# Altium project UHF RFID reder.PrjPcb (part 2 of 2)

## Sheet External interfaces and connections.SchDoc
size A4; SheetNumber: 10; SheetTotal: 10
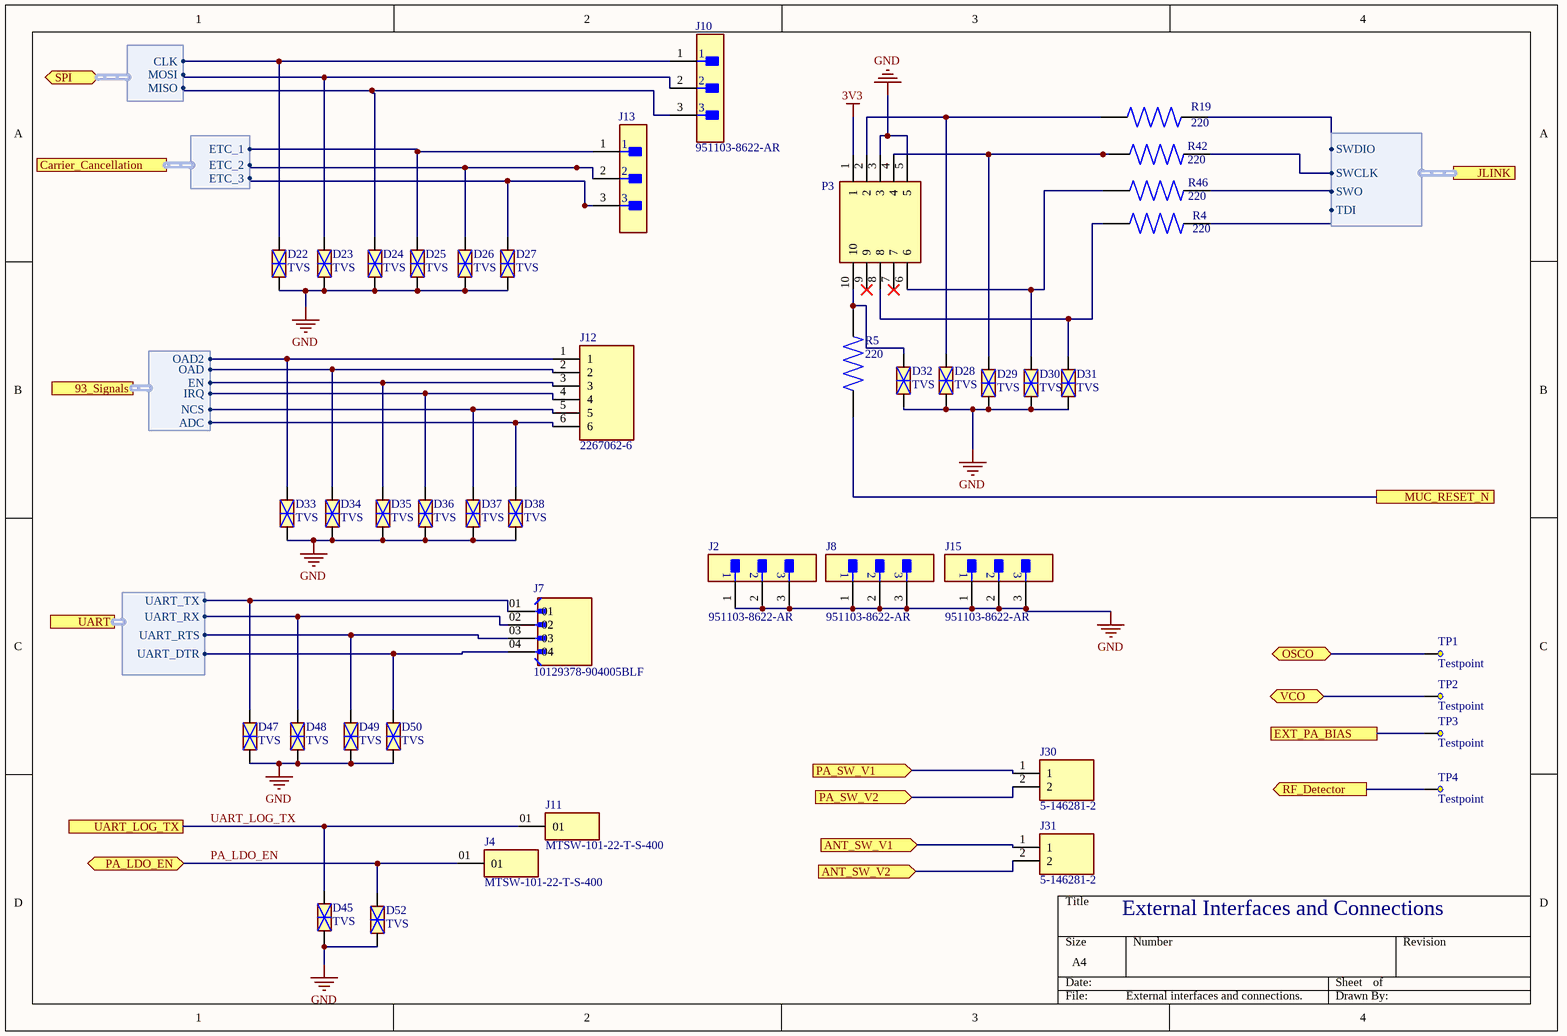
[diagram p6: External interfaces and connections.SchDoc]

### Parts
D22  TVS  [ST0201]
D23  TVS  [ST0201]
D24  TVS  [ST0201]
D25  TVS  [ST0201]
D26  TVS  [ST0201]
D27  TVS  [ST0201]
D28  TVS  [ST0201]
D29  TVS  [ST0201]
D30  TVS  [ST0201]
D31  TVS  [ST0201]
D32  TVS  [ST0201]
D33  TVS  [ST0201]
D34  TVS  [ST0201]
D35  TVS  [ST0201]
D36  TVS  [ST0201]
D37  TVS  [ST0201]
D38  TVS  [ST0201]
D45  TVS  [ST0201]
D47  TVS  [ST0201]
D48  TVS  [ST0201]
D49  TVS  [ST0201]
D50  TVS  [ST0201]
D52  TVS  [ST0201]
J2  951103-8622-AR  [FP-951103-8622-AR-MFG]
J4  MTSW-101-22-T-S-400  [SAMTEC_MTSW-101-22-T-S-400]
J7  10129378-904005BLF  [AMPHENOL_10129378-904005BLF]
J8  951103-8622-AR  [FP-951103-8622-AR-MFG]
J10  951103-8622-AR  [FP-951103-8622-AR-MFG]
J11  MTSW-101-22-T-S-400  [SAMTEC_MTSW-101-22-T-S-400]
J12  2267062-6  [TE_2267062-6]
J13  951103-8622-AR  [FP-951103-8622-AR-MFG]  (value not drawn)
J15  951103-8622-AR  [FP-951103-8622-AR-MFG]
J30  5-146281-2  [TE_5-146281-2]
J31  5-146281-2  [TE_5-146281-2]
P3  .06.04_J-LINK_NEEDLE_ADAPTER  [SEGGER_8.06.04_J-LINK_NEEDLE_ADAPTER]  (value not drawn)
R4  220  [RESC1005X40N]
R5  220  [RESC1005X40N]
R19  220  [RESC1005X40N]
R42  220  [RESC1005X40N]
R46  220  [RESC1005X40N]
TP1  Testpoint  [Testpoint_FP]
TP2  Testpoint  [Testpoint_FP]
TP3  Testpoint  [Testpoint_FP]
TP4  Testpoint  [Testpoint_FP]

### Ports
93_Signals (harness 93_Signals, see System Overview[1B], Microcontroller[4A], UHF RFID READER IC[1A]), ANT_SW_V1 (in, see System Overview[1D], Antenna Switch[2B], Microcontroller[1C]), ANT_SW_V2 (in, see System Overview[1D], Antenna Switch[2B], Microcontroller[1C]), Carrier_Cancellation (harness Carrier_Cancellation, see System Overview[1B], Carrier Cancellation Circuit[1A], Microcontroller[4B]), EXT_PA_BIAS (see System Overview[1C], External Power Amplifier[1C]), JLINK (harness JLINK, see System Overview[1C], Microcontroller[1B]), MUC_RESET_N (see System Overview[1C], Microcontroller[3B]), OSCO (bidir, see System Overview[1C], UHF RFID READER IC[1B]), PA_LDO_EN (bidir, see System Overview[1C], Microcontroller[1B], Supply LDOs[2C]), PA_SW_V1 (in, see System Overview[1C], External Power Amplifier[4A], Microcontroller[1B]), PA_SW_V2 (in, see System Overview[1C], External Power Amplifier[4A], Microcontroller[3A]), RF_Detector (out, see System Overview[1C], External Power Amplifier[3D], Microcontroller[2A]), SPI (bidir, harness SPI, see System Overview[1B], Carrier Cancellation Circuit[1A], Microcontroller[4A], UHF RFID READER IC[1A]), UART (harness UART, see System Overview[1C], Microcontroller[1A], USB suply_UART bridge[4D]), UART_LOG_TX (see System Overview[1C], Microcontroller[4A]), VCO (bidir, see System Overview[1C], UHF RFID READER IC[1B])

### Harnesses
93_Signals: EN, IRQ, NCS, ADC, OAD, OAD2
Carrier_Cancellation: ETC_1, ETC_2, ETC_3
SPI: CLK, MISO, MOSI
UART: UART_TX, UART_RX, UART_RTS, UART_DTR
JLINK: SWDIO, SWCLK, SWO, TDI

### Nets
3V3: P3.1
GND: D22.2 D23.2 D24.2 D25.2 D26.2 D27.2 D28.2 D29.1 D29.2 D30.2 D31.2 D32.2 D33.2 D34.2 D35.2 D36.2 D37.2 D38.2 D45.2 D47.2 D48.2 D49.2 D50.2 D52.2 J2.1 J2.2 J2.3 J8.1 J8.2 J8.3 J15.1 J15.2 J15.3 P3.3 P3.4 P3.5 R42.1
ADC: D38.1 J12.6 ; port 93_Signals.ADC
CLK: D22.1 J10.1 ; port SPI.CLK
Detector: TP4.TP?(Testpoint) ; port RF_Detector
DTR: D50.1 J7.04 ; port UART.UART_DTR
EN: D35.1 J12.3 ; port 93_Signals.EN
ETC_1: D25.1 J13.1 ; port Carrier_Cancellation.ETC_1
ETC_2: D26.1 J13.2 ; port Carrier_Cancellation.ETC_2
ETC_3: D27.1 J13.3 ; port Carrier_Cancellation.ETC_3
IRQ: D36.1 J12.4 ; port 93_Signals.IRQ
MISO: D24.1 J10.3 ; port SPI.MISO
MOSI: D23.1 J10.2 ; port SPI.MOSI
NCS: D37.1 J12.5 ; port 93_Signals.NCS
OAD: D34.1 J12.2 ; port 93_Signals.OAD
OAD2: D33.1 J12.1 ; port 93_Signals.OAD2
OSCO: TP1.TP?(Testpoint) ; port OSCO
PA_LDO_EN: D52.1 J4.01 ; port PA_LDO_EN
RTS: D49.1 J7.03 ; port UART.UART_RTS
RX: D48.1 J7.02 ; port UART.UART_RX
TX: D47.1 J7.01 ; port UART.UART_TX
UART_LOG_TX: D45.1 J11.01 ; port UART_LOG_TX
NetB1_1: R5.1 ; port MUC_RESET_N
NetC55_2: TP2.TP?(Testpoint) ; port VCO
NetD28_1: D28.1 P3.2 R19.1
NetD30_1: D30.1 P3.6 R46.1
NetD31_1: D31.1 P3.8 R4.1
NetD32_1: D32.1 P3.10 R5.2
NetJ30_1: J30.1 ; port PA_SW_V1
NetJ30_2: J30.2 ; port PA_SW_V2
NetJ31_1: J31.1 ; port ANT_SW_V1
NetJ31_2: J31.2 ; port ANT_SW_V2
NetR4_2: R4.2 ; port JLINK.TDI
NetR19_2: R19.2 ; port JLINK.SWDIO
NetR21_2: TP3.TP?(Testpoint) ; port EXT_PA_BIAS
NetR42_2: R42.2 ; port JLINK.SWCLK
NetR46_2: R46.2 ; port JLINK.SWO

Not connected (* = marked no-connect by the designer): P3 7* 9*

### Notes on the sheet
- External Interfaces and Connections

### Library data of the parts
D22-D38 D45 D47-D50 D52 = ESDAXLC6-1BU2: 17V Clamp 1A (8/20Âµs) Ipp Tvs Diode Surface Mount ST0201; MF: STMicroelectronics; SnapEDA_Link: https://www.snapeda.com/parts/ESDAXLC6-1BU2/STMicroelectronics/view-part/?ref=snap; Package: 0201 STMicroelectronics; Value: *; MP: ESDAXLC6-1BU2; Check_prices: https://www.snapeda.com/parts/ESDAXLC6-1BU2/STMicroelectronics/view-part/?ref=eda
J2 J8 J10 J13 J15 = CMP-05379-000003-1: CONN HEADER VERT 3POS 2MM; Manufacturer: 3M; Conn Gender: Male; Current Rating: 2A; Number Of Contacts: 3; Conn Orientation: Straight; Digikey Description: CONN HEADER VERT 3POS 2MM; Device Class L3: unset; Category: Conn; Height: 6.3mm; Manufacturer Part Number: 951103-8622-AR; RoHS: TRUE; Contact Material: Gold,Nickel; ComponentLink2Description: Datasheet; Temperature Range Low: -55°C; Device Class L1: Connectors; Pitch: 2mm; Mouser Description: Header; PinStrip; CopperAlloy; HighTempThermoplastic; 3Cnts; 1A; RtAngle; 951Series; Octopart: https://octopart.com/951103-8622-ar-3m-14400669; Package: 951103-8622-AR; Lead Free: Yes; Device Class L2: Headers and Wire Housings; Temperature Range High: +125°C; ComponentLink2URL: http://multimedia.3m.com/mws/media/1400506O/3m-pin-strip-header-951-series-78-5100-2653-3.pdf; Automotive: No; Temperature: -55°C to +125°C; Number Of Rows: 1
J4 J11 = MTSW-101-22-T-S-400: Connector Header Through Hole 1 position; MF: Samtec; Check_prices: https://www.snapeda.com/parts/MTSW-101-22-T-S-400/Samtec/view-part/?ref=eda; Purchase-URL: https://pricing.snapeda.com/search/part/MTSW-101-22-T-S-400/?ref=eda; SnapEDA_Link: https://www.snapeda.com/parts/MTSW-101-22-T-S-400/Samtec/view-part/?ref=snap; Price: None; Value: *; MP: MTSW-101-22-T-S-400; Package: None; Availability: In Stock
J7 = 10129378-904005BLF: Headers & Wire Housings 10129378-904005BLF-HEADER SR VT TH 1*4; MF: Amphenol; Package: None; Value: *; Check_prices: https://www.snapeda.com/parts/10129378-904005BLF/Amphenol/view-part/?ref=eda; SnapEDA_Link: https://www.snapeda.com/parts/10129378-904005BLF/Amphenol/view-part/?ref=snap; Availability: In Stock; Purchase-URL: https://pricing.snapeda.com/search/part/10129378-904005BLF/?ref=eda; MP: 10129378-904005BLF; Price: None
J30 J31 = 5-146281-2: Header; Breakaway; 0.100 in.; PC Board; Single; 2; 0.025 in.; 0.12 in.; 3 A; MF: TE Connectivity; Number_of_Positions: 2; Centerline_Pitch: 2.54 mm[.1 in]; Product_Type: Connector; EU_RoHS_Compliance: Compliant; SnapEDA_Link: https://www.snapeda.com/parts/5-146281-2/TE%20Connectivity%20AMP%20Connectors/view-part/457165/?ref=snap; Price: None; MP: 5-146281-2; Package: None; Value: *; Availability: Unavailable
P3 = 8.06.04_J-LINK_NEEDLE_ADAPTER: J-LINK 10-PIN NEEDLE ADAPTER; MF: Segger Microcontroller; MP: 8.06.04 J-LINK NEEDLE ADAPTER; Package: None; Value: *; Availability: No availability data; Check_prices: https://www.snapeda.com/parts/8.06.04%20J-LINK%20NEEDLE%20ADAPTER/Segger%20Microcontroller%20Systems/view-part/2780259/?ref=eda; Price: None; SnapEDA_Link: https://www.snapeda.com/parts/8.06.04%20J-LINK%20NEEDLE%20ADAPTER/Segger%20Microcontroller%20Systems/view-part/2780259/?ref=snap
R4 R5 R19 R42 R46 = RC0402JR-07220RL: 220 Ohms ±5% 0.063W, 1/16W Chip Resistor 0402 (1005 Metric) Moisture Resistant Thick Film; MF: Yageo; SnapEDA_Link: https://www.snapeda.com/parts/RC0402JR-07220RL/Yageo/view-part/?ref=snap; Package: 1005 Panasonic Electronic Components; Value: *; MP: RC0402JR-07220RL; Check_prices: https://www.snapeda.com/parts/RC0402JR-07220RL/Yageo/view-part/?ref=eda
J12 = 2267062-6: Package: None; Price: None; Value: *; MP: 2267062-6; Availability: Unavailable

## Sheet Microcontroller.SchDoc
size A4; SheetNumber: 8; SheetTotal: 10
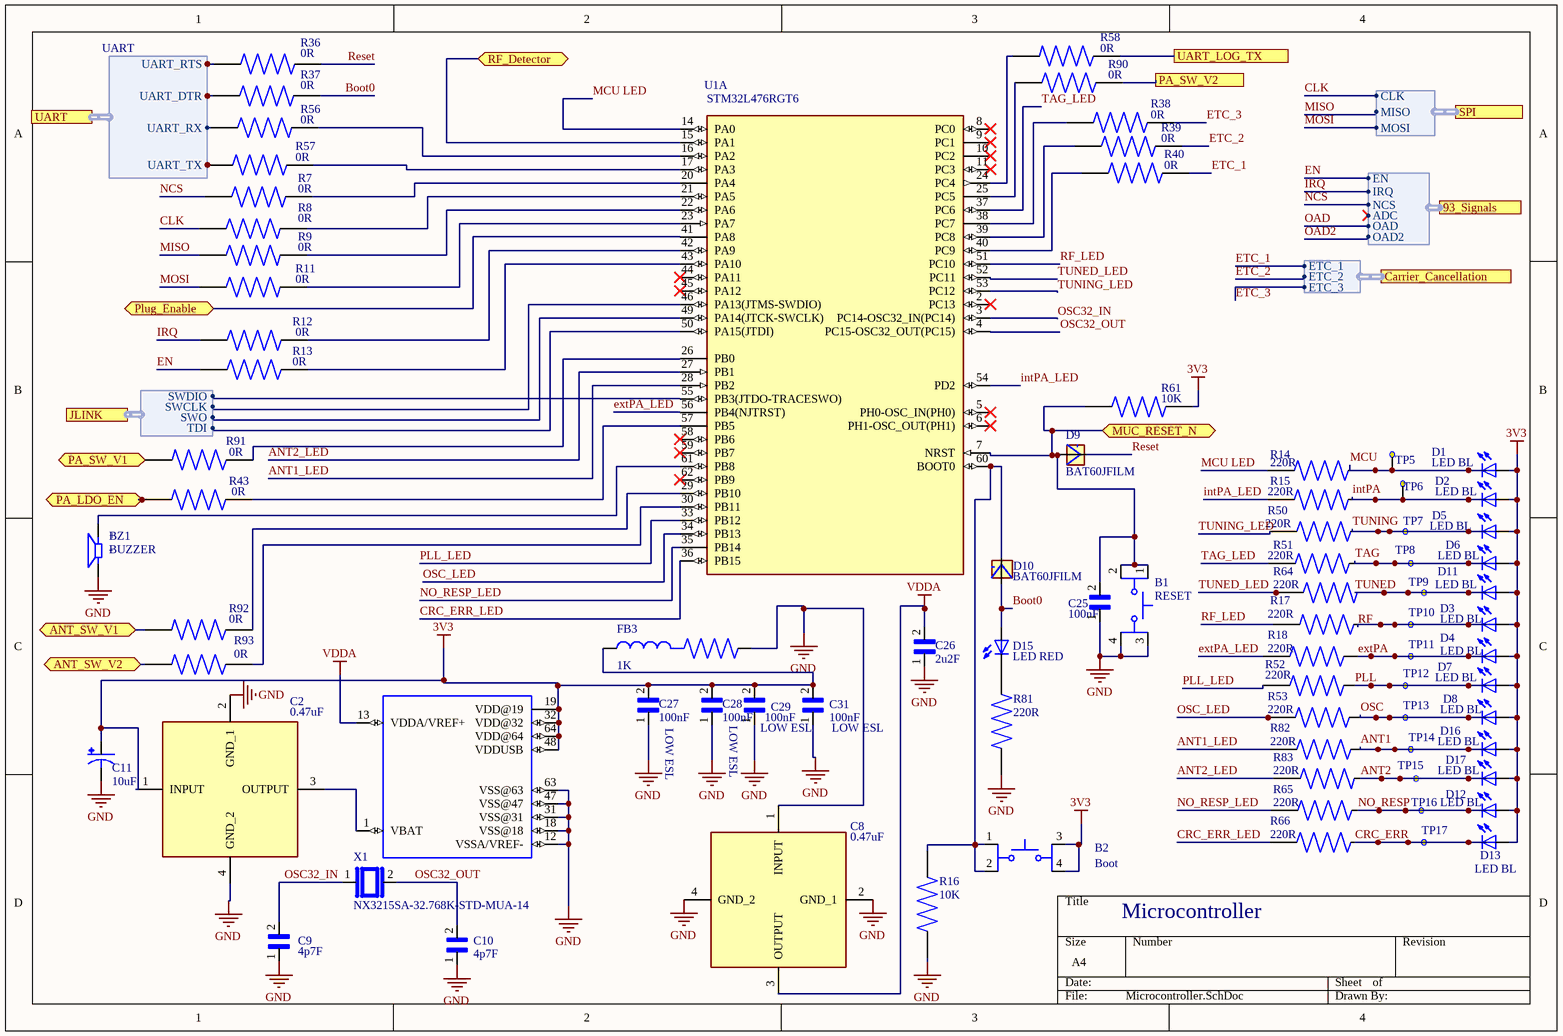
[diagram p7: Microcontroller.SchDoc]

### Parts
B1  RESET  [SW_TL3301AF160QG]
B2  Boot  [SW_TL3301AF160QG]
BZ1  BUZZER  [SPKR_PKMCS0909E4000-R1]
C2  0.47uF  [NFM18CC101R1C3D]
C8  0.47uF  [NFM18CC101R1C3D]
C9  4p7F  [CAPC1005X55N]
C10  4p7F  [CAPC1005X55N]
C11  10uF  [2917(POL)]
C25  100nF  [CAPC1005X55N]
C26  2u2F  [CAPC0603X35N]
C27  100nF  [CAPC0510X35N]
C28  100nF  [CAPC0510X35N]
C29  100nF  [CAPC0510X35N]
C31  100nF  [CAPC0510X35N]
D1  LED BL  [LED_0402]
D2  LED BL  [LED_0402]
D3  LED BL  [LED_0402]
D4  LED BL  [LED_0402]
D5  LED BL  [LED_0402]
D6  LED BL  [LED_0402]
D7  LED BL  [LED_0402]
D8  LED BL  [LED_0402]
D9  BAT60JFILM  [SOD323]
D10  BAT60JFILM  [SOD323]
D11  LED BL  [LED_0402]
D12  LED BL  [LED_0402]
D13  LED BL  [LED_0402]
D15  LED RED  [LED_0402]
D16  LED BL  [LED_0402]
D17  LED BL  [LED_0402]
FB3  1K  [BEADC1005X55N]
R7  0R  [RESC1005X37N]
R8  0R  [RESC1005X37N]
R9  0R  [RESC1005X37N]
R11  0R  [RESC1005X37N]
R12  0R  [RESC1005X37N]
R13  0R  [RESC1005X37N]
R14  220R  [RESC1005X40N]
R15  220R  [RESC1005X40N]
R16  10K  [RESC1005X40N]
R17  220R  [RESC1005X40N]
R18  220R  [RESC1005X40N]
R36  0R  [RESC1005X37N]
R37  0R  [RESC1005X37N]
R38  0R  [RESC1005X37N]
R39  0R  [RESC1005X37N]
R40  0R  [RESC1005X37N]
R43  0R  [RESC1005X37N]
R50  220R  [RESC1005X40N]
R51  220R  [RESC1005X40N]
R52  220R  [RESC1005X40N]
R53  220R  [RESC1005X40N]
R56  0R  [RESC1005X37N]
R57  0R  [RESC1005X37N]
R58  0R  [RESC1005X37N]
R61  10K  [RESC1005X40N]
R64  220R  [RESC1005X40N]
R65  220R  [RESC1005X40N]
R66  220R  [RESC1005X40N]
R81  220R  [RESC1005X40N]
R82  220R  [RESC1005X40N]
R83  220R  [RESC1005X40N]
R90  0R  [RESC1005X37N]
R91  0R  [RESC1005X37N]
R92  0R  [RESC1005X37N]
R93  0R  [RESC1005X37N]
TP5  Testpoint  [Testpoint_FP]  (value not drawn)
TP6  Testpoint  [Testpoint_FP]  (value not drawn)
TP7  Testpoint  [Testpoint_FP]  (value not drawn)
TP8  Testpoint  [Testpoint_FP]  (value not drawn)
TP9  Testpoint  [Testpoint_FP]  (value not drawn)
TP10  Testpoint  [Testpoint_FP]  (value not drawn)
TP11  Testpoint  [Testpoint_FP]  (value not drawn)
TP12  Testpoint  [Testpoint_FP]  (value not drawn)
TP13  Testpoint  [Testpoint_FP]  (value not drawn)
TP14  Testpoint  [Testpoint_FP]  (value not drawn)
TP15  Testpoint  [Testpoint_FP]  (value not drawn)
TP16  Testpoint  [Testpoint_FP]  (value not drawn)
TP17  Testpoint  [Testpoint_FP]  (value not drawn)
U1A  STM32L476RGT6  [LQFP-64(10X10)MM]
X1  NX3215SA-32.768K-STD-MUA-14  [XTAL_NX3215SA-32.768K-STD-MUA-14]

### Ports
93_Signals (harness 93_Signals, see System Overview[2B], External interfaces and connections[1B], UHF RFID READER IC[1A]), ANT_SW_V1 (bidir, see System Overview[2C], Antenna Switch[2B], External interfaces and connections[3D]), ANT_SW_V2 (bidir, see System Overview[2C], Antenna Switch[2B], External interfaces and connections[3D]), Carrier_Cancellation (harness Carrier Cancellation, see System Overview[2B], Carrier Cancellation Circuit[1A], External interfaces and connections[1A]), JLINK (harness JLINK, see System Overview[2C], External interfaces and connections[4A]), MUC_RESET_N (bidir, see System Overview[2C], External interfaces and connections[4B]), PA_LDO_EN (bidir, see System Overview[2C], External interfaces and connections[1D], Supply LDOs[2C]), PA_SW_V1 (bidir, see System Overview[2C], External interfaces and connections[3C], External Power Amplifier[4A]), PA_SW_V2 (see System Overview[2C], External interfaces and connections[3D], External Power Amplifier[4A]), Plug_Enable (bidir, see System Overview[2D], Supply LDOs[1B]), RF_Detector (bidir, see System Overview[2C], External interfaces and connections[4D], External Power Amplifier[3D]), SPI (harness SPI, see System Overview[2B], Carrier Cancellation Circuit[1A], External interfaces and connections[1A], UHF RFID READER IC[1A]), UART (harness UART, see System Overview[2C], External interfaces and connections[1C], USB suply_UART bridge[4D]), UART_LOG_TX (see System Overview[2C], External interfaces and connections[1D])

### Harnesses
UART: UART_RTS, UART_DTR, UART_RX, UART_TX
JLINK: SWDIO, SWCLK, SWO, TDI
SPI: CLK, MISO, MOSI
93_Signals: EN, IRQ, NCS, ADC, OAD, OAD2
Carrier Cancellation: ETC_1, ETC_2, ETC_3

### Nets
3V3: B2.3 B2.4 C2.1(INPUT) C11.1(POS) C27.2 C28.2 C29.2 C31.2 D1.A D2.A D3.A D4.A D5.A D6.A D7.A D8.A D11.A D12.A D13.A D16.A D17.A FB3.1 R61.2 U1A.19(VDD@19) U1A.32(VDD@32) U1A.48(VDDUSB) U1A.64(VDD@64)
GND: B1.3 B1.4 BZ1.2(N) C2.2(GND_1) C2.4(GND_2) C8.1(INPUT) C8.2(GND_1) C8.4(GND_2) C9.1 C10.1 C11.2(NEG) C25.1 C26.1 C27.1 C28.1 C29.1 C31.1 FB3.2 R16.1 R81.1 U1A.12(VSSA/VREF-) U1A.18(VSS@18) U1A.31(VSS@31) U1A.47(VSS@47) U1A.63(VSS@63)
VDDA: C8.3(OUTPUT) C26.2 U1A.13(VDDA/VREF+)
ANT1: D16.C R82.2 TP14.TP?(Testpoint)
ANT1_LED: R82.1 U1A.28(PB2)
ANT2: D17.C R83.2 TP15.TP?(Testpoint)
ANT2_LED: R83.1 U1A.27(PB1)
Boot0: D10.A D15.A R37.2
CLK: R8.1 ; port SPI.CLK
CRC_ERR: D13.C R66.2 TP17.TP?(Testpoint)
CRC_ERR_LED: R66.1 U1A.36(PB15)
Detector: U1A.15(PA1) ; port RF_Detector
DTR: R37.1 ; port UART.UART_DTR
EN: R13.1 ; port 93_Signals.EN
ETC_1: R40.2 ; port Carrier_Cancellation.ETC_1
ETC_2: R39.2 ; port Carrier_Cancellation.ETC_2
ETC_3: R38.2 ; port Carrier_Cancellation.ETC_3
extPA: D4.C R18.2 TP11.TP?(Testpoint)
extPA_LED: R18.1 U1A.56(PB4(NJTRST))
intPA: D2.C R15.2 TP6.TP?(Testpoint)
intPA_LED: R15.1 U1A.54(PD2)
IRQ: R12.1 ; port 93_Signals.IRQ
MCU: D1.C R14.2 TP5.TP?(Testpoint)
MCU LED: R14.1 U1A.14(PA0)
MISO: R9.1 ; port SPI.MISO
MOSI: R11.1 ; port SPI.MOSI
NCS: R7.1 ; port 93_Signals.NCS
NO_RESP: D12.C R65.2 TP16.TP?(Testpoint)
NO_RESP_LED: R65.1 U1A.35(PB14)
OSC: D8.C R53.2 TP13.TP?(Testpoint)
OSC32_IN: C9.2 U1A.3(PC14-OSC32_IN(PC14)) X1.1
OSC32_OUT: C10.2 U1A.4(PC15-OSC32_OUT(PC15)) X1.2
OSC_LED: R53.1 U1A.34(PB13)
PA_LDO_EN: R43.1 ; port PA_LDO_EN
PLL: D7.C R52.2 TP12.TP?(Testpoint)
PLL_LED: R52.1 U1A.33(PB12)
Reset: D9.C R36.2
RF: D3.C R17.2 TP10.TP?(Testpoint)
RF_LED: R17.1 U1A.51(PC10)
RTS: R36.1 ; port UART.UART_RTS
RX: R56.1 ; port UART.UART_RX
TAG: D6.C R51.2 TP8.TP?(Testpoint)
TAG_LED: R51.1 U1A.37(PC6)
TUNED: D11.C R64.2 TP9.TP?(Testpoint)
TUNED_LED: R64.1 U1A.52(PC11)
TUNING: D5.C R50.2 TP7.TP?(Testpoint)
TUNING_LED: R50.1 U1A.53(PC12)
TX: R57.1 ; port UART.UART_TX
UART_LOG_TX: R58.2 ; port UART_LOG_TX
NetB1_1: B1.1 B1.2 C25.2 D9.A R61.1 U1A.7(NRST) ; port MUC_RESET_N
NetB2_1: B2.1 B2.2 D10.C R16.2 U1A.60(BOOT0)
NetBZ1_1: BZ1.1(P) U1A.61(PB8)
NetC2_3: C2.3(OUTPUT) U1A.1(VBAT)
NetD15_C: D15.C R81.2
NetJ14_3: U1A.41(PA8) ; port Plug_Enable
NetJ30_1: R91.1 ; port PA_SW_V1
NetJ30_2: R90.2 ; port PA_SW_V2
NetJ31_1: R92.1 ; port ANT_SW_V1
NetJ31_2: R93.1 ; port ANT_SW_V2
NetR4_2: U1A.50(PA15(JTDI)) ; port JLINK.TDI
NetR7_2: R7.2 U1A.20(PA4)
NetR8_2: R8.2 U1A.21(PA5)
NetR9_2: R9.2 U1A.22(PA6)
NetR11_2: R11.2 U1A.23(PA7)
NetR12_2: R12.2 U1A.42(PA9)
NetR13_2: R13.2 U1A.43(PA10)
NetR19_2: U1A.55(PB3(JTDO-TRACESWO)) ; port JLINK.SWDIO
NetR38_1: R38.1 U1A.38(PC7)
NetR39_1: R39.1 U1A.39(PC8)
NetR40_1: R40.1 U1A.40(PC9)
NetR42_2: U1A.46(PA13(JTMS-SWDIO)) ; port JLINK.SWCLK
NetR43_2: R43.2 U1A.57(PB5)
NetR46_2: U1A.49(PA14(JTCK-SWCLK)) ; port JLINK.SWO
NetR56_2: R56.2 U1A.16(PA2)
NetR57_2: R57.2 U1A.17(PA3)
NetR58_1: R58.1 U1A.24(PC4)
NetR90_1: R90.1 U1A.25(PC5)
NetR91_2: R91.2 U1A.26(PB0)
NetR92_2: R92.2 U1A.29(PB10)
NetR93_2: R93.2 U1A.30(PB11)

Not connected (* = marked no-connect by the designer): U1A 2(PC13)* 5(PH0-OSC_IN(PH0))* 6(PH1-OSC_OUT(PH1))* 8(PC0)* 9(PC1)* 10(PC2)* 11(PC3)* 44(PA11)* 45(PA12)* 58(PB6)* 59(PB7)* 62(PB9)*

### Notes on the sheet
- (near U1A) LOW ESL
- Microcontroller
- (in symbol PKMCS0909E4000-R1) +; -

### Library data of the parts
B1 B2 = TL3301AF160QG: Tactile Switch SPST-NO Top Actuated Surface Mount; MF: E-Switch; SnapEDA_Link: https://www.snapeda.com/parts/TL3301AF160QG/E-Switch/view-part/?ref=snap; Package: None; MP: TL3301AF160QG; Check_prices: https://www.snapeda.com/parts/TL3301AF160QG/E-Switch/view-part/?ref=eda; Purchase-URL: https://pricing.snapeda.com/search/part/TL3301AF160QG/?ref=eda; Digi-Key_Part_Number: EG2526TR-ND; Value: *
BZ1 = PKMCS0909E4000-R1: Buzzers Transducer, Externally Driven Piezo 1.5V 4kHz 65dB @ 1.5V, 10cm Surface Mount Solder Pads; MF: Murata; SnapEDA_Link: https://www.snapeda.com/parts/PKMCS0909E4000-R1/Murata/view-part/4970136/?ref=snap; Arrow_Electronics-Purchase-URL: https://snapeda.com/shop?store=Arrow+Electronics&id=4970136; DigiKey-Purchase-URL: https://snapeda.com/shop?store=DigiKey&id=4970136; Digi-Key_Part_Number: 490-9647-1-ND; MP: PKMCS0909E4000-R1; Package: SMD-2 Murata; Mouser-Purchase-URL: https://snapeda.com/shop?store=Mouser&id=4970136; Value: *
C2 C8 = NFM18PS474R0J3D: Capacitor; Manufacturer_Name: Murata Electronics; Datasheet Link: https://psearch.en.murata.com/capacitor/product/NFM18PS474R0J3%23.html; Height: 0.7mm; Manufacturer_Part_Number: NFM18PS474R0J3D; Mouser Part Number: 81-NFM18PS474R0J3D; Mouser Price/Stock: https://www.mouser.co.uk/ProductDetail/Murata-Electronics/NFM18PS474R0J3D?qs=OWtbBJ4e7yHgIGJxSdBqtA%3D%3D; Arrow Part Number: NFM18PS474R0J3D; Arrow Price/Stock: https://www.arrow.com/en/products/nfm18ps474r0j3d/murata-manufacturing?region=nac
C9 C10 = GRM1555C2A4R7CA01D: Cap Ceramic 4.7pF 100V C0G 0.25pF SMD 0402 125Â°C Paper T/R; Package: None; Price: None; Value: *; MP: GRM1555C2A4R7CA01D; Availability: Unavailable
C11 = ECASD41C106M060K00: 10 ÂµF 16 V Aluminum - Polymer Capacitors 2917 (7343 Metric) 60mOhm 1000 Hrs @ 105Â°C; MF: Murata Electronics; SnapEDA_Link: https://www.snapeda.com/parts/ECASD41C106M060K00/Murata+Electronics+North+America/view-part/?ref=snap; Package: 2917 Murata; Value: *; MP: ECASD41C106M060K00; Check_prices: https://www.snapeda.com/parts/ECASD41C106M060K00/Murata+Electronics+North+America/view-part/?ref=eda
C25 = GRM155R71C104KA88D: SMD Capacitor X7R_EIA_ with Capacitance: 0.10uF Tol. 10%. Rated Voltage: 16Vdc; MF: Murata; Package: 1005 Taiyo Yuden; Value: *; MP: GRM155R71C104KA88D; SnapEDA_Link: https://www.snapeda.com/parts/GRM155R71C104KA88D/Murata%20Electronics%20North%20America/view-part/4750/?ref=snap
C26 = GRM033R60J225ME15D: SMD Capacitor X5R(EIA) with Capacitance: 2.2uF Tol. 20%. Rated Voltage: 6.3Vdc; Package: None; Price: None; Value: *; MP: GRM033R60J225ME15D; Availability: Unavailable
C27-C29 C31 = LLL153C80J104ME01E: SMD Capacitor X6S(EIA) with Capacitance: 0.10uF Tol. 20%. Rated Voltage: 6.3Vdc; MF: Murata; Price: None; Value: *; Purchase-URL: https://pricing.snapeda.com/search/part/LLL153C80J104ME01E/?ref=eda; Package: 0510 Murata; SnapEDA_Link: https://www.snapeda.com/parts/LLL153C80J104ME01E/Murata/view-part/4376162/?ref=snap; Availability: Good; MP: LLL153C80J104ME01E
D1-D8 D11-D13 D16 D17 = LNJ947W8CRA: Blue 472nm LED Indication - Discrete 2.9V 0402 (1005 Metric); MF: Panasonic Electronic; SnapEDA_Link: https://www.snapeda.com/parts/LNJ947W8CRA/Panasonic+Electronic+Components/view-part/?ref=snap; Package: 0402 Panasonic; Value: *; MP: LNJ947W8CRA; Check_prices: https://www.snapeda.com/parts/LNJ947W8CRA/Panasonic+Electronic+Components/view-part/?ref=eda
D9 D10 = BAT60JFILM: Diode Schottky 10 V 3A (DC) Surface Mount SOD-323; MF: STMicroelectronics; Package: SOD-323 STMicroelectronics; Price: None; Check_prices: https://www.snapeda.com/parts/BAT60JFILM/STMicroelectronics/view-part/?ref=eda; Value: *; SnapEDA_Link: https://www.snapeda.com/parts/BAT60JFILM/STMicroelectronics/view-part/?ref=snap; MP: BAT60JFILM; Availability: In Stock; Purchase-URL: https://pricing.snapeda.com/search?q=BAT60JFILM&ref=eda
D15 = LNJ247W82RA: Red 630nm LED Indication - Discrete 1.95V 0402 (1005 Metric); MF: Panasonic Electronic; Package: 0402 Panasonic; Price: None; Check_prices: https://www.snapeda.com/parts/LNJ247W82RA/Panasonic+Electronic+Components/view-part/?ref=eda; Value: *; SnapEDA_Link: https://www.snapeda.com/parts/LNJ247W82RA/Panasonic+Electronic+Components/view-part/?ref=snap; MP: LNJ247W82RA; Availability: In Stock; Purchase-URL: https://pricing.snapeda.com/search?q=LNJ247W82RA&ref=eda
FB3 = BLM15HG102SN1D: 1 kOhms @ 100MHz 1 Signal Line Ferrite Bead 0402 _1005 Metric_ 250mA 1.1Ohm; MF: Murata; Value: *; SnapEDA_Link: https://www.snapeda.com/parts/BLM15HG102SN1D/Murata/view-part/270056/?ref=snap; Digi-Key_Part_Number: 490-3999-1-ND; Digi-Key_Purchase_URL: https://www.digikey.com/product-detail/en/murata-electronics/BLM15HG102SN1D/490-3999-1-ND/1016259?utm_source=snapeda&utm_medium=aggregator&utm_campaign=symbol; Package: 1005 Taiyo Yuden; MP: BLM15HG102SN1D
R7-R9 R11-R13 R36-R40 R43 R56-R58 R90-R93 = RC0402JR-070RL: MF: {'manufacturer': u'YAGEO'}; Package: None; Price: None; Value: *; MP: RC0402JR-070RL; Availability: Unavailable
R14 R15 R17 R18 R50-R53 R64-R66 R81-R83 = RC0402JR-07220RL: as R4 on sheet External interfaces and connections; SnapEDA_Link: https://www.snapeda.com/parts/RC0402JR-07220RL/Yageo/view-part/?ref=snap; Package: 1005 Panasonic Electronic Components; Value: *; MP: RC0402JR-07220RL; Check_prices: https://www.snapeda.com/parts/RC0402JR-07220RL/Yageo/view-part/?ref=eda
R16 R61 = RC0402FR-0710KL: 10 kOhms Â±1% 0.063W, 1/16W Chip Resistor 0402 (1005 Metric) Moisture Resistant Thick Film; MF: Yageo; Package: 0402 Yageo; Price: None; Check_prices: https://www.snapeda.com/parts/RC0402FR-0710KL/Yageo/view-part/?ref=eda; Value: *; SnapEDA_Link: https://www.snapeda.com/parts/RC0402FR-0710KL/Yageo/view-part/?ref=snap; MP: RC0402FR-0710KL; Availability: In Stock; Purchase-URL: https://pricing.snapeda.com/search?q=RC0402FR-0710KL&ref=eda
U1A = STM32L476RGT6: ARMÂ® CortexÂ®-M4 STM32L4 Microcontroller IC 32-Bit Single-Core 80MHz 1MB (1M x 8) FLASH 64-LQFP (10x10); MF: STMicroelectronics; Package: LQFP-64 STMicroelectronics; Price: None; Check_prices: https://www.snapeda.com/parts/STM32L476RGT6/STMicroelectronics/view-part/?ref=eda; Value: *; SnapEDA_Link: https://www.snapeda.com/parts/STM32L476RGT6/STMicroelectronics/view-part/?ref=snap; MP: STM32L476RGT6; Availability: In Stock; Purchase-URL: https://pricing.snapeda.com/search?q=STM32L476RGT6&ref=eda
X1 = NX3215SA-32.768K-STD-MUA-14: 32.768 kHz Â±20ppm Crystal 6pF 70 kOhms 2-SMD, No Lead; MF: NDK America,; SnapEDA_Link: https://www.snapeda.com/parts/NX3215SA-32.768K-STD-MUA-14/NDK+America%252C+Inc./view-part/?ref=snap; Package: SMD-2 NDK; Value: *; MP: NX3215SA-32.768K-STD-MUA-14; Check_prices: https://www.snapeda.com/parts/NX3215SA-32.768K-STD-MUA-14/NDK+America%252C+Inc./view-part/?ref=eda

## Sheet Supply LDOs.SchDoc
size A4; SheetNumber: 9; SheetTotal: 10
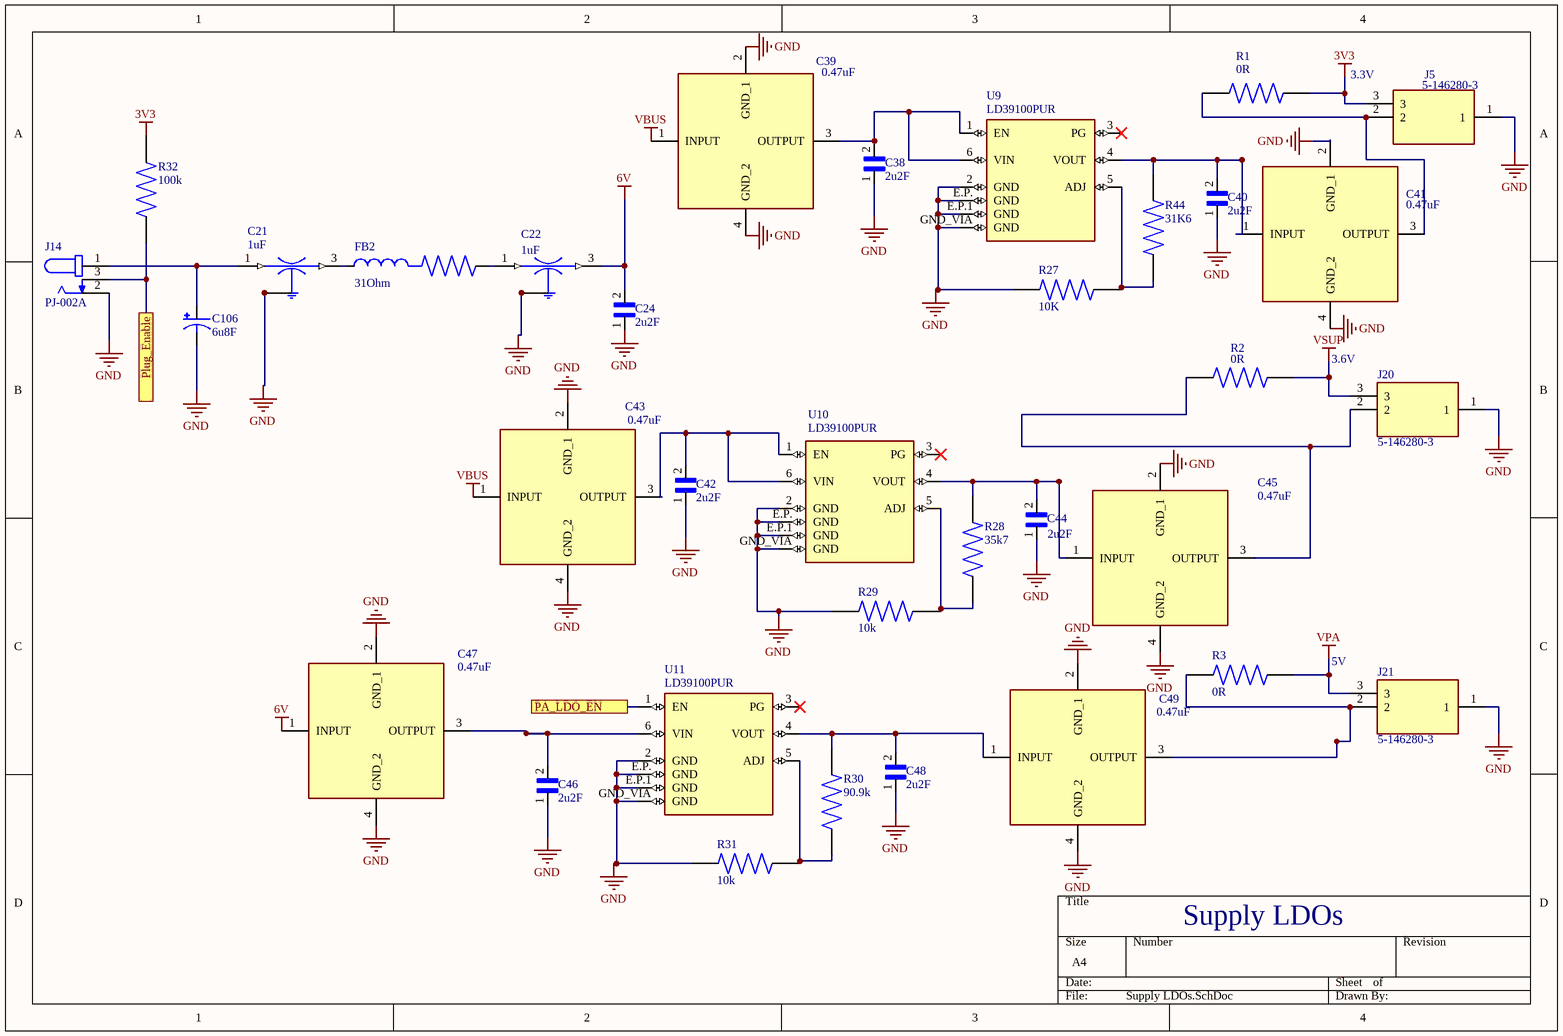
[diagram p8: Supply LDOs.SchDoc]

### Parts
C21  1uF  [FIL_NFM21PC105B1A3D]
C22  1uF  [FIL_NFM21PC105B1A3D]
C24  2u2F  [CAPC0603X35N]
C38  2u2F  [CAPC1005X55N]
C39  0.47uF  [NFM18CC101R1C3D]
C40  2u2F  [CAPC1005X55N]
C41  0.47uF  [NFM18CC101R1C3D]
C42  2u2F  [CAPC1005X55N]
C43  0.47uF  [NFM18CC101R1C3D]
C44  2u2F  [CAPC1005X55N]
C45  0.47uF  [NFM18CC101R1C3D]
C46  2u2F  [CAPC1005X55N]
C47  0.47uF  [NFM18CC101R1C3D]
C48  2u2F  [CAPC1005X55N]
C49  0.47uF  [NFM18CC101R1C3D]
C106  6u8F  [2917(POL)]
FB2  31Ohm  [FIL_NFZ32BW310HN11L]
J5  5-146280-3  [TE_5-146280-3]
J14  PJ-002A  [CUI_PJ-002A]
J20  5-146280-3  [TE_5-146280-3]
J21  5-146280-3  [TE_5-146280-3]
R1  0R  [RESC1607X60N]
R2  0R  [RESC1607X60N]
R3  0R  [RESC1607X60N]
R27  10K  [RESC1005X40N]
R28  35k7  [RESC1005X40N]
R29  10k  [RESC1005X40N]
R30  90.9k  [RES_ERJ2RKF4222X]
R31  10k  [RESC1005X40N]
R32  100k  [RESC1005X40N]
R44  31K6  [RESC1005X40N]
U9  LD39100PUR  [DFN6-3X3MM]
U10  LD39100PUR  [DFN6-3X3MM]
U11  LD39100PUR  [DFN6-3X3MM]

### Ports
PA_LDO_EN (see System Overview[1D], External interfaces and connections[1D], Microcontroller[1B]), Plug_Enable (see System Overview[1D], Microcontroller[1B])

### Nets
3V3: J5.3 R1.2 R32.2
6V: C22.3(OUT) C24.2 C47.1(INPUT)
GND: C21.2(GND) C21.2_1(GND) C21.2_2(GND) C21.2_3(GND) C21.2_4(GND) C22.2(GND) C22.2_1(GND) C22.2_2(GND) C22.2_3(GND) C22.2_4(GND) C24.1 C38.1 C39.2(GND_1) C39.4(GND_2) C40.1 C41.2(GND_1) C41.4(GND_2) C42.1 C43.2(GND_1) C43.4(GND_2) C44.1 C45.2(GND_1) C45.4(GND_2) C46.1 C47.2(GND_1) C47.4(GND_2) C48.1 C49.2(GND_1) C49.4(GND_2) C106.2(NEG) J5.1 J14.2 J20.1 J21.1 R27.2 R29.2 R31.2 U9.2(GND) U9.E.P.(GND) U9.E.P.1(GND) U9.GND_VIA(GND) U10.2(GND) U10.E.P.(GND) U10.E.P.1(GND) U10.GND_VIA(GND) U11.2(GND) U11.E.P.(GND) U11.E.P.1(GND) U11.GND_VIA(GND)
VBUS: C39.1(INPUT) C43.1(INPUT)
VPA: J21.3 R3.2
VSUP: J20.3 R2.2
PA_LDO_EN: U11.1(EN) ; port PA_LDO_EN
NetC21_1: C21.1(IN) C106.1(POS) J14.1
NetC21_3: C21.3(OUT) FB2.1
NetC22_1: C22.1(IN) FB2.2
NetC38_2: C38.2 C39.3(OUTPUT) U9.1(EN) U9.6(VIN)
NetC40_2: C40.2 C41.1(INPUT) R44.2 U9.4(VOUT)
NetC41_3: C41.3(OUTPUT) J5.2 R1.1
NetC42_2: C42.2 C43.3(OUTPUT) U10.1(EN) U10.6(VIN)
NetC44_2: C44.2 C45.1(INPUT) R28.2 U10.4(VOUT)
NetC45_3: C45.3(OUTPUT) J20.2 R2.1
NetC46_2: C46.2 C47.3(OUTPUT) U11.6(VIN)
NetC48_2: C48.2 C49.1(INPUT) R30.2 U11.4(VOUT)
NetC49_3: C49.3(OUTPUT) J21.2 R3.1
NetJ14_3: J14.3 R32.1 ; port Plug_Enable
NetR27_1: R27.1 R44.1 U9.5(ADJ)
NetR28_1: R28.1 R29.1 U10.5(ADJ)
NetR30_1: R30.1 R31.1 U11.5(ADJ)

Not connected (* = marked no-connect by the designer): U9 3(PG)*; U10 3(PG)*; U11 3(PG)*

### Notes on the sheet
- (near J5) 3.3V
- 3.6V
- 5V
- Supply LDOs

### Library data of the parts
C21 C22 = NFM21PC105B1A3D: SMD Capacitor with Capacitance: 1.0uF Tol. 20%. Rated Voltage: 10Vdc; MF: Murata; Value: *; Package: NONSTANDARD; Price: None; MP: NFM21PC105B1A3D; Availability: Unavailable; SnapEDA_Link: https://www.snapeda.com/parts/NFM21PC105B1A3D/Murata/view-part/4380627/?ref=snap
C24 = GRM033R60J225ME15D: as C26 on sheet Microcontroller; Package: None; Price: None; Value: *; MP: GRM033R60J225ME15D; Availability: Unavailable
C38 C40 C42 C44 C46 C48 = GRM155R60J225ME95D: CAPACITOR, MLCC, X5R, 2.2UF, 6.3V, 0402; Package: None; Price: None; Value: *; MP: GRM155R60J225ME95D; Availability: Unavailable
C39 C41 C43 C45 C47 C49 = NFM18PS474R0J3D: as C2 on sheet Microcontroller; Datasheet Link: https://psearch.en.murata.com/capacitor/product/NFM18PS474R0J3%23.html; Height: 0.7mm; Manufacturer_Part_Number: NFM18PS474R0J3D; Mouser Part Number: 81-NFM18PS474R0J3D; Mouser Price/Stock: https://www.mouser.co.uk/ProductDetail/Murata-Electronics/NFM18PS474R0J3D?qs=OWtbBJ4e7yHgIGJxSdBqtA%3D%3D; Arrow Part Number: NFM18PS474R0J3D; Arrow Price/Stock: https://www.arrow.com/en/products/nfm18ps474r0j3d/murata-manufacturing?region=nac
C106 = ECASD41C685M070K00: 6.8 µF 16 V Aluminum - Polymer Capacitors 2917 (7343 Metric) 70mOhm 1000 Hrs @ 105°C; MF: Murata; SnapEDA_Link: https://www.snapeda.com/parts/ECASD41C685M070K00/Murata/view-part/?ref=snap; Package: 2917 Murata; Value: *; MP: ECASD41C685M070K00; Check_prices: https://www.snapeda.com/parts/ECASD41C685M070K00/Murata/view-part/?ref=eda
FB2 = NFZ32BW310HN11L: 31 Ohms @ 1MHz 1 Ferrite Bead 2-SMD, Flat Lead 1.2A 186mOhm; MF: Murata; Availability: Warning; MP: NFZ32BW310HN11L; Price: None; Value: *; SnapEDA_Link: https://www.snapeda.com/parts/NFZ32BW310HN11L/Murata/view-part/2726849/?ref=snap; Purchase-URL: https://pricing.snapeda.com/search/part/NFZ32BW310HN11L/?ref=eda; Package: SMD-2 Murata
J5 J20 J21 = 5-146280-3: Header; Conn; Interconnect System; PCB Plug; 3 Cont; Thru-Hole; Breakaway; Straight; 3A; Centerline_Pitch: 2.54 mm[.1 in]; MF: TE Connectivity; Product_Type: Connector; Number_of_Positions: 3; SnapEDA_Link: https://www.snapeda.com/parts/5-146280-3/TE%20Connectivity%20AMP%20Connectors/view-part/2778485/?ref=snap; MP: 5-146280-3; TE_purchase_URL: https://www.te.com/usa-en/product-5-146280-3.html?te_bu=Cor&te_type=disp&te_campaign=seda_glo_cor-seda-global-disp-prtnr-fy19-seda-model-bom-cta_sma-317_1&elqCampaignId=32493; Availability: Unavailable; Price: None; Package: None; Value: *
J14 = PJ-002A: 2.0 x 6.5 mm, 2.5 A, Horizontal, Through Hole, Dc Power Jack Connector; MF: CUI Devices; MP: PJ-002A; Check_prices: https://www.snapeda.com/parts/PJ-002A/CUI+Devices/view-part/?ref=eda; Availability: In Stock; CUI_purchase_URL: https://www.cuidevices.com/product/interconnect/connectors/dc-power-connectors/jacks/pj-002a?utm_source=snapeda.com&utm_medium=referral&utm_campaign=snapedaBOM; SnapEDA_Link: https://www.snapeda.com/parts/PJ-002A/CUI+Devices/view-part/?ref=snap; Purchase-URL: https://pricing.snapeda.com/search/part/PJ-002A/?ref=eda; Price: None; Package: None; Value: *
R1-R3 = RC0603JR-070RL: Thick film general purpose; Availability: Unavailable; Package: None; MP: RC0603JR-070RL; Value: *; Price: None
R27 R29 R31 = RC0402FR-0710KL: as R16 on sheet Microcontroller; Package: 0402 Yageo; Price: None; Check_prices: https://www.snapeda.com/parts/RC0402FR-0710KL/Yageo/view-part/?ref=eda; Value: *; SnapEDA_Link: https://www.snapeda.com/parts/RC0402FR-0710KL/Yageo/view-part/?ref=snap; MP: RC0402FR-0710KL; Availability: In Stock; Purchase-URL: https://pricing.snapeda.com/search?q=RC0402FR-0710KL&ref=eda
R28 = RC0402FR-0735K7L: RES SMD 35.7K OHM 1% 1/16W 0402; Package: None; Price: None; Value: *; MP: RC0402FR-0735K7L; Availability: Unavailable
R30 = ERJ2RKF4222X: Value: *; Package: None; MP: ERJ2RKF4222X; Price: None; Availability: Unavailable
R32 = RCG0402100KFKED: Res Thick Film 0402 100K Ohm 1% 1/16W Â±100ppm/Â°C Molded SMD; Package: None; Price: None; Value: *; MP: RCG0402100KFKED; Availability: Unavailable
R44 = RC0402FR-0731K6L: Thick film general purpose; Package: None; Price: None; Value: *; MP: RC0402FR-0731K6L; Availability: Unavailable
U9-U11 = LD39100PUR: Ð›Ð¸Ð½ÐµÐ¹Ð½Ñ‹Ð¹ Ñ€ÐµÐ³ÑƒÐ»ÑÑ‚Ð¾Ñ€ Ð½Ð°Ð¿Ñ€ÑÐ¶ÐµÐ½Ð¸Ñ IC Ñ Ð¿Ð¾Ð»Ð¾Ð¶Ð¸Ñ‚ÐµÐ»ÑŒÐ½Ñ‹Ð¼ Ñ€ÐµÐ³ÑƒÐ»Ð¸Ñ€Ð¾Ð²Ð°Ð½Ð¸ÐµÐ¼ 1 Ð²Ñ‹Ñ…Ð¾Ð´ 1A 6-DFN (3x3); MF: STMicroelectronics; SnapEDA_Link: https://www.snapeda.com/parts/LD39100PUR/STMicroelectronics/view-part/?ref=snap; Package: DFN-6 STMicroelectronics; Value: *; MP: LD39100PUR; Check_prices: https://www.snapeda.com/parts/LD39100PUR/STMicroelectronics/view-part/?ref=eda

## Sheet RF SHIELD.SchDoc
size A4; SheetNumber: 5; SheetTotal: 5
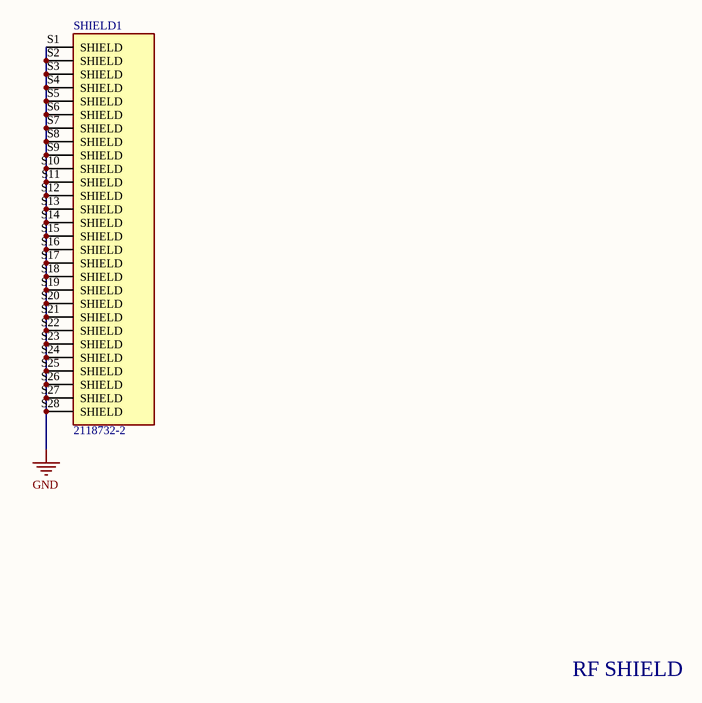
[diagram p9: RF SHIELD.SchDoc]

### Parts
SHIELD1  2118732-2  [TE_2118732-2]

### Nets
GND: SHIELD1.S1(SHIELD) SHIELD1.S2(SHIELD) SHIELD1.S3(SHIELD) SHIELD1.S4(SHIELD) SHIELD1.S5(SHIELD) SHIELD1.S6(SHIELD) SHIELD1.S7(SHIELD) SHIELD1.S8(SHIELD) SHIELD1.S9(SHIELD) SHIELD1.S10(SHIELD) SHIELD1.S11(SHIELD) SHIELD1.S12(SHIELD) SHIELD1.S13(SHIELD) SHIELD1.S14(SHIELD) SHIELD1.S15(SHIELD) SHIELD1.S16(SHIELD) SHIELD1.S17(SHIELD) SHIELD1.S18(SHIELD) SHIELD1.S19(SHIELD) SHIELD1.S20(SHIELD) SHIELD1.S21(SHIELD) SHIELD1.S22(SHIELD) SHIELD1.S23(SHIELD) SHIELD1.S24(SHIELD) SHIELD1.S25(SHIELD) SHIELD1.S26(SHIELD) SHIELD1.S27(SHIELD) SHIELD1.S28(SHIELD)

### Notes on the sheet
- RF SHIELD

### Library data of the parts
SHIELD1 = 2118732-2: EMI Filters; Board Level Shielding (BLS); STD SHIELD FRAME; CRS-50.80X38.10X5.08MM; MF: TE Connectivity; DigiKey-Purchase-URL: https://snapeda.com/shop?store=DigiKey&id=1493072; Availability: Warning; Package: None; MP: 2118732-2; Value: *; Mouser-Purchase-URL: https://snapeda.com/shop?store=Mouser&id=1493072; SnapEDA_Link: https://www.snapeda.com/parts/2118732-2/TE%20Connectivity%20AMP%20Connectors/view-part/1493072/?ref=snap; Price: None

## Nets that join several sheets
3V3: UHF RFID READER IC (C50.2 C69.2 FB4.1 U5.38), External Power Amplifier (C15.2 C70.2 U3.2 U3.8), Carrier Cancellation Circuit (9 pins), USB suply_UART bridge (R6.2), External interfaces and connections (P3.1), Microcontroller (27 pins), Supply LDOs (J5.3 R1.2 R32.2)
GND: UHF RFID READER IC (58 pins), External Power Amplifier (35 pins), Antenna Switch (18 pins), Carrier Cancellation Circuit (29 pins), USB suply_UART bridge (26 pins), External interfaces and connections (37 pins), Microcontroller (25 pins), Supply LDOs (49 pins), RF SHIELD (28 pins)
VBUS: USB suply_UART bridge (C99.1 D20.2 P2.1), Supply LDOs (C39.1 C43.1)
VPA: External Power Amplifier (C16.1 C20.1 C104.1), Supply LDOs (J21.3 R3.2)
VSUP: UHF RFID READER IC (C91.3 C92.1), Supply LDOs (J20.3 R2.2)
ADC: UHF RFID READER IC (U5.39), External interfaces and connections (D38.1 J12.6)
CLK: UHF RFID READER IC (U5.37), Carrier Cancellation Circuit (U6.5 U7.5 U8.5), External interfaces and connections (D22.1 J10.1), Microcontroller (R8.1)
Detector: External Power Amplifier (U3.7), External interfaces and connections (TP4.TP?), Microcontroller (U1A.15)
DTR: USB suply_UART bridge (U13.18), External interfaces and connections (D50.1 J7.04), Microcontroller (R37.1)
EN: UHF RFID READER IC (U5.31), External interfaces and connections (D35.1 J12.3), Microcontroller (R13.1)
ETC_1: Carrier Cancellation Circuit (U6.6), External interfaces and connections (D25.1 J13.1), Microcontroller (R40.2)
ETC_2: Carrier Cancellation Circuit (U7.6), External interfaces and connections (D26.1 J13.2), Microcontroller (R39.2)
ETC_3: Carrier Cancellation Circuit (U8.6), External interfaces and connections (D27.1 J13.3), Microcontroller (R38.2)
IRQ: UHF RFID READER IC (U5.32), External interfaces and connections (D36.1 J12.4), Microcontroller (R12.1)
MISO: UHF RFID READER IC (U5.34), External interfaces and connections (D24.1 J10.3), Microcontroller (R9.1)
MOSI: UHF RFID READER IC (U5.35), Carrier Cancellation Circuit (U6.7 U7.7 U8.7), External interfaces and connections (D23.1 J10.2), Microcontroller (R11.1)
NCS: UHF RFID READER IC (U5.33), External interfaces and connections (D37.1 J12.5), Microcontroller (R7.1)
NetB1_1: External interfaces and connections (R5.1), Microcontroller (6 pins)
NetC55_2: UHF RFID READER IC (C55.2 R33.1), External interfaces and connections (TP2.TP?)
NetC107_2: UHF RFID READER IC (J9.C), External Power Amplifier (C107.2)
NetC112_2: Antenna Switch (C112.2), Carrier Cancellation Circuit (T4.6)
NetJ1_A: UHF RFID READER IC (T5.1), External Power Amplifier (J1.A)
NetJ14_3: Microcontroller (U1A.41), Supply LDOs (J14.3 R32.1)
NetJ30_1: External Power Amplifier (S1.1), External interfaces and connections (J30.1), Microcontroller (R91.1)
NetJ30_2: External Power Amplifier (S1.3), External interfaces and connections (J30.2), Microcontroller (R90.2)
NetJ31_1: Antenna Switch (S2.1), External interfaces and connections (J31.1), Microcontroller (R92.1)
NetJ31_2: Antenna Switch (S2.3), External interfaces and connections (J31.2), Microcontroller (R93.1)
NetR4_2: External interfaces and connections (R4.2), Microcontroller (U1A.50)
NetR19_2: External interfaces and connections (R19.2), Microcontroller (U1A.55)
NetR21_2: External Power Amplifier (R21.2 U2.1), External interfaces and connections (TP3.TP?)
NetR42_2: External interfaces and connections (R42.2), Microcontroller (U1A.46)
NetR46_2: External interfaces and connections (R46.2), Microcontroller (U1A.49)
NetT2_1: External Power Amplifier (T2.1), Carrier Cancellation Circuit (T4.1)
OAD: UHF RFID READER IC (U5.27), External interfaces and connections (D34.1 J12.2)
OAD2: UHF RFID READER IC (U5.26), External interfaces and connections (D33.1 J12.1)
OSCO: UHF RFID READER IC (C51.1 R54.1 U5.30), External interfaces and connections (TP1.TP?)
PA_LDO_EN: External interfaces and connections (D52.1 J4.01), Microcontroller (R43.1), Supply LDOs (U11.1)
RTS: USB suply_UART bridge (U13.19), External interfaces and connections (D49.1 J7.03), Microcontroller (R36.1)
RX: USB suply_UART bridge (U13.1), External interfaces and connections (D48.1 J7.02), Microcontroller (R56.1)
RX_N: UHF RFID READER IC (C94.1), Carrier Cancellation Circuit (T6.3)
RX_P: UHF RFID READER IC (C93.1), Carrier Cancellation Circuit (T6.4)
TX: USB suply_UART bridge (U13.17), External interfaces and connections (D47.1 J7.01), Microcontroller (R57.1)
UART_LOG_TX: External interfaces and connections (D45.1 J11.01), Microcontroller (R58.2)